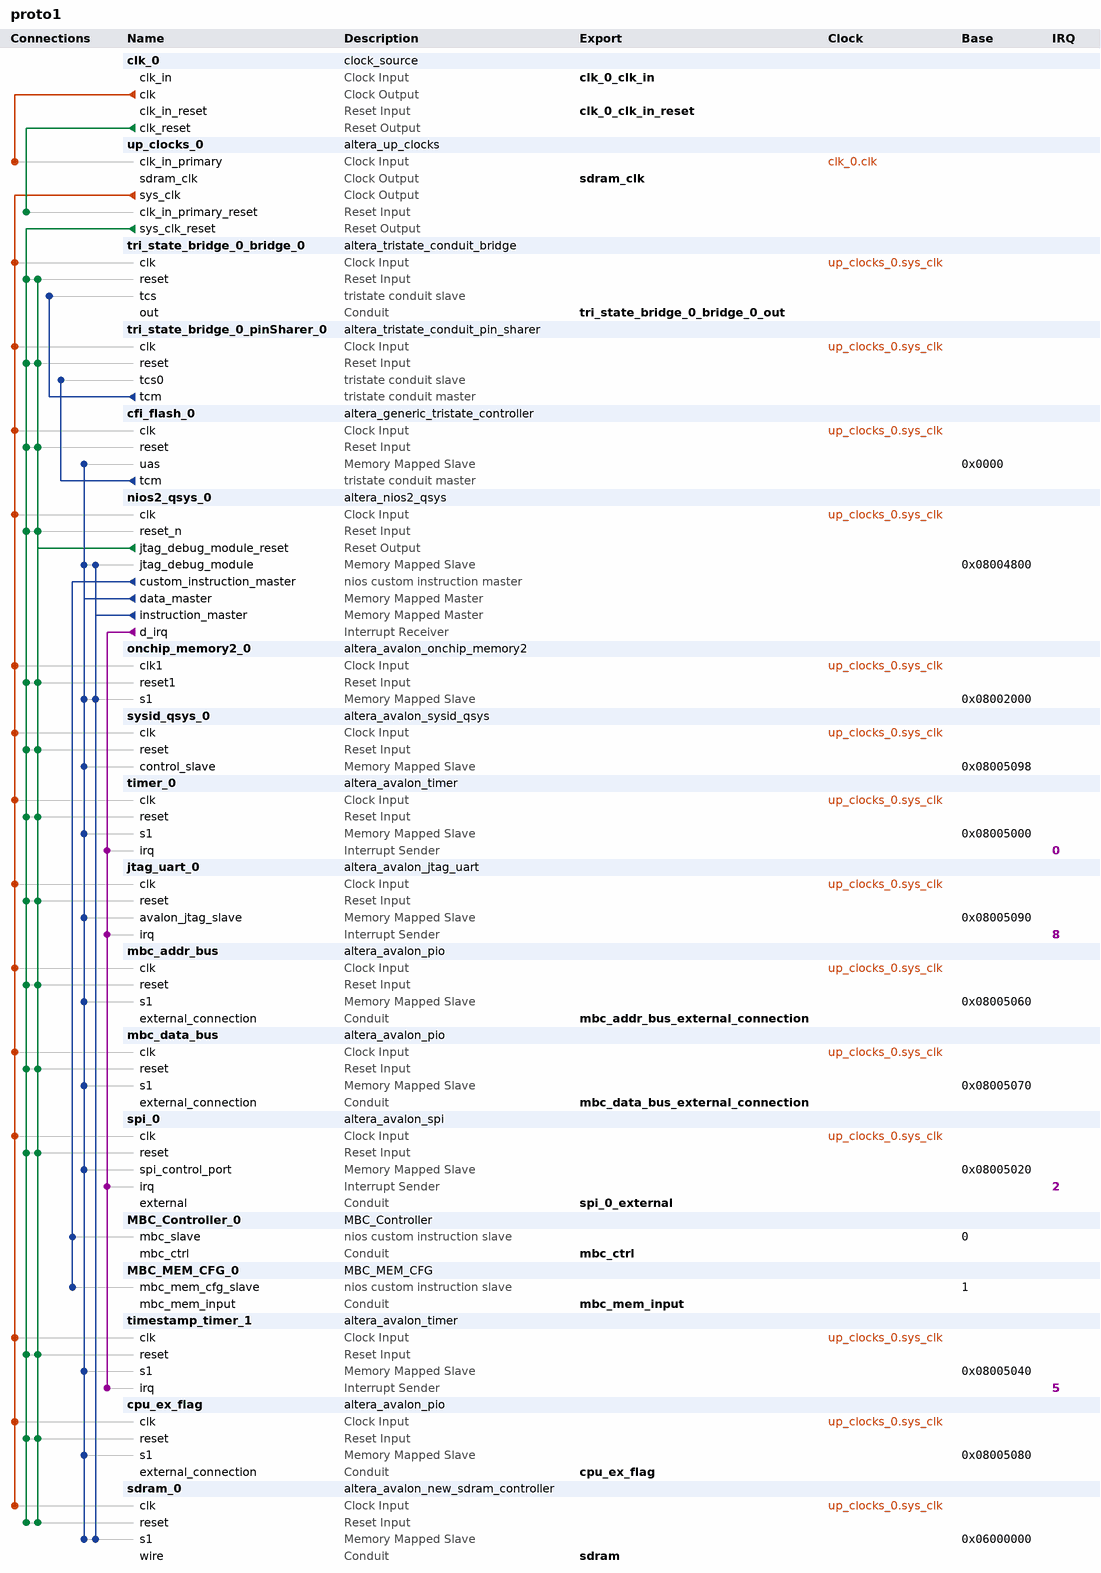
[diagram p0: system contents]
# Platform Designer (Qsys) system proto1, Cyclone IV E EP4CE22F17C6
# Parameters at their usual value, and those the tool derives, are not listed.
package require -exact qsys 12.0
create_system proto1
set_project_property DEVICE_FAMILY {Cyclone IV E}
set_project_property DEVICE EP4CE22F17C6

add_instance clk_0 clock_source 12.0
set_instance_parameter_value clk_0 clockFrequency 50000000

add_instance up_clocks_0 altera_up_clocks 12.0
set_instance_parameter_value up_clocks_0 board DE0-Nano
set_instance_parameter_value up_clocks_0 vga_clk false
set_instance_parameter_value up_clocks_0 audio_clk true
set_instance_parameter_value up_clocks_0 audio_clk_freq 12.288

add_instance tri_state_bridge_0_bridge_0 altera_tristate_conduit_bridge 12.0

add_instance tri_state_bridge_0_pinSharer_0 altera_tristate_conduit_pin_sharer 12.0
set_instance_parameter_value tri_state_bridge_0_pinSharer_0 NUM_INTERFACES 1
set_instance_parameter_value tri_state_bridge_0_pinSharer_0 MODULE_ORIGIN_LIST cfi_flash_0.tcm,cfi_flash_0.tcm,cfi_flash_0.tcm,cfi_flash_0.tcm,cfi_flash_0.tcm
set_instance_parameter_value tri_state_bridge_0_pinSharer_0 SHARED_SIGNAL_LIST address_to_the_cfi_flash_0,read_n_to_the_cfi_flash_0,write_n_to_the_cfi_flash_0,data_to_and_from_the_cfi_flash_0,select_n_to_the_cfi_flash_0

add_instance cfi_flash_0 altera_generic_tristate_controller 12.0
set_instance_parameter_value cfi_flash_0 TCM_ADDRESS_W 26
set_instance_parameter_value cfi_flash_0 TCM_DATA_W 16
set_instance_parameter_value cfi_flash_0 TCM_BYTEENABLE_W 2
set_instance_parameter_value cfi_flash_0 TCM_READ_WAIT 100
set_instance_parameter_value cfi_flash_0 TCM_WRITE_WAIT 100
set_instance_parameter_value cfi_flash_0 TCM_SETUP_WAIT 25
set_instance_parameter_value cfi_flash_0 TCM_DATA_HOLD 20
set_instance_parameter_value cfi_flash_0 TCM_MAX_PENDING_READ_TRANSACTIONS 3
set_instance_parameter_value cfi_flash_0 TCM_TURNAROUND_TIME 2
set_instance_parameter_value cfi_flash_0 TCM_TIMING_UNITS 0
set_instance_parameter_value cfi_flash_0 TCM_READLATENCY 2
set_instance_parameter_value cfi_flash_0 TCM_SYMBOLS_PER_WORD 2
set_instance_parameter_value cfi_flash_0 USE_READ 1
set_instance_parameter_value cfi_flash_0 USE_BEGINTRANSFER 0
set_instance_parameter_value cfi_flash_0 USE_BYTEENABLE 0
set_instance_parameter_value cfi_flash_0 USE_OUTPUTENABLE 0
set_instance_parameter_value cfi_flash_0 ACTIVE_LOW_READ 1
set_instance_parameter_value cfi_flash_0 ACTIVE_LOW_BYTEENABLE 0
set_instance_parameter_value cfi_flash_0 ACTIVE_LOW_OUTPUTENABLE 0
set_instance_parameter_value cfi_flash_0 ACTIVE_LOW_BEGINTRANSFER 0
set_instance_parameter_value cfi_flash_0 CHIPSELECT_THROUGH_READLATENCY 0
set_instance_parameter_value cfi_flash_0 MODULE_ASSIGNMENT_KEYS embeddedsw.configuration.hwClassnameDriverSupportList,embeddedsw.configuration.hwClassnameDriverSupportDefault,embeddedsw.CMacro.SETUP_VALUE,embeddedsw.CMacro.WAIT_VALUE,embeddedsw.CMacro.HOLD_VALUE,embeddedsw.CMacro.TIMING_UNITS,embeddedsw.CMacro.SIZE,embeddedsw.memoryInfo.MEM_INIT_DATA_WIDTH,embeddedsw.memoryInfo.HAS_BYTE_LANE,embeddedsw.memoryInfo.IS_FLASH,embeddedsw.memoryInfo.GENERATE_DAT_SYM,embeddedsw.memoryInfo.GENERATE_FLASH,embeddedsw.memoryInfo.DAT_SYM_INSTALL_DIR,embeddedsw.memoryInfo.FLASH_INSTALL_DIR
set_instance_parameter_value cfi_flash_0 MODULE_ASSIGNMENT_VALUES altera_avalon_lan91c111:altera_avalon_cfi_flash,altera_avalon_cfi_flash,25,100,20,ns,33554432u,16,1,1,1,1,SIM_DIR,APP_DIR
set_instance_parameter_value cfi_flash_0 INTERFACE_ASSIGNMENT_KEYS embeddedsw.configuration.isFlash,embeddedsw.configuration.isMemoryDevice,embeddedsw.configuration.isNonVolatileStorage
set_instance_parameter_value cfi_flash_0 INTERFACE_ASSIGNMENT_VALUES 1,1,1

add_instance nios2_qsys_0 altera_nios2_qsys 12.0
set_instance_parameter_value nios2_qsys_0 manuallyAssignCpuID false
set_instance_parameter_value nios2_qsys_0 resetSlave sdram_0.s1
set_instance_parameter_value nios2_qsys_0 exceptionSlave sdram_0.s1
set_instance_parameter_value nios2_qsys_0 breakSlave nios2_qsys_0.jtag_debug_module
set_instance_parameter_value nios2_qsys_0 impl Tiny
set_instance_parameter_value nios2_qsys_0 icache_size 4096

add_instance onchip_memory2_0 altera_avalon_onchip_memory2 12.0
set_instance_parameter_value onchip_memory2_0 allowInSystemMemoryContentEditor true
set_instance_parameter_value onchip_memory2_0 dataWidth 32
set_instance_parameter_value onchip_memory2_0 dualPort false
set_instance_parameter_value onchip_memory2_0 initMemContent true
set_instance_parameter_value onchip_memory2_0 initializationFileName onchip_memory2_0
set_instance_parameter_value onchip_memory2_0 instanceID MAIN
set_instance_parameter_value onchip_memory2_0 memorySize 8192
set_instance_parameter_value onchip_memory2_0 singleClockOperation true

add_instance sysid_qsys_0 altera_avalon_sysid_qsys 12.0
set_instance_parameter_value sysid_qsys_0 id 0

add_instance timer_0 altera_avalon_timer 12.0
set_instance_parameter_value timer_0 period 1
set_instance_parameter_value timer_0 periodUnits MSEC
set_instance_parameter_value timer_0 timerPreset FULL_FEATURED

add_instance jtag_uart_0 altera_avalon_jtag_uart 12.0
set_instance_parameter_value jtag_uart_0 simInteractiveOptions INTERACTIVE_ASCII_OUTPUT

add_instance mbc_addr_bus altera_avalon_pio 12.0
set_instance_parameter_value mbc_addr_bus direction Output
set_instance_parameter_value mbc_addr_bus width 5

add_instance mbc_data_bus altera_avalon_pio 12.0
set_instance_parameter_value mbc_data_bus direction Input
set_instance_parameter_value mbc_data_bus width 8

add_instance spi_0 altera_avalon_spi 12.0
set_instance_parameter_value spi_0 clockPolarity 0
set_instance_parameter_value spi_0 dataWidth 32
set_instance_parameter_value spi_0 masterSPI true
set_instance_parameter_value spi_0 numberOfSlaves 1
set_instance_parameter_value spi_0 targetClockRate 128000

add_instance MBC_Controller_0 MBC_Controller 1.8
set_instance_parameter_value MBC_Controller_0 DEFAULT_LUT_SIZE 256
set_instance_parameter_value MBC_Controller_0 DEFAULT_SCHED_TBL_SIZE 16

add_instance MBC_MEM_CFG_0 MBC_MEM_CFG 1.2

add_instance timestamp_timer_1 altera_avalon_timer 12.0
set_instance_parameter_value timestamp_timer_1 period 1
set_instance_parameter_value timestamp_timer_1 periodUnits MSEC
set_instance_parameter_value timestamp_timer_1 timerPreset FULL_FEATURED

add_instance cpu_ex_flag altera_avalon_pio 12.0
set_instance_parameter_value cpu_ex_flag direction Output
set_instance_parameter_value cpu_ex_flag width 1

add_instance sdram_0 altera_avalon_new_sdram_controller 12.0
set_instance_parameter_value sdram_0 TAC 5.5
set_instance_parameter_value sdram_0 TRCD 20.0
set_instance_parameter_value sdram_0 TRP 20.0
set_instance_parameter_value sdram_0 casLatency 3
set_instance_parameter_value sdram_0 columnWidth 9
set_instance_parameter_value sdram_0 dataWidth 16
set_instance_parameter_value sdram_0 generateSimulationModel false
set_instance_parameter_value sdram_0 model custom
set_instance_parameter_value sdram_0 numberOfBanks 4
set_instance_parameter_value sdram_0 numberOfChipSelects 1
set_instance_parameter_value sdram_0 powerUpDelay 100.0
set_instance_parameter_value sdram_0 refreshPeriod 15.625
set_instance_parameter_value sdram_0 rowWidth 13

# connections
add_connection clk_0.clk up_clocks_0.clk_in_primary clock
add_connection up_clocks_0.sys_clk cfi_flash_0.clk clock
add_connection up_clocks_0.sys_clk cpu_ex_flag.clk clock
add_connection up_clocks_0.sys_clk jtag_uart_0.clk clock
add_connection up_clocks_0.sys_clk mbc_addr_bus.clk clock
add_connection up_clocks_0.sys_clk mbc_data_bus.clk clock
add_connection up_clocks_0.sys_clk nios2_qsys_0.clk clock
add_connection up_clocks_0.sys_clk onchip_memory2_0.clk1 clock
add_connection up_clocks_0.sys_clk sdram_0.clk clock
add_connection up_clocks_0.sys_clk spi_0.clk clock
add_connection up_clocks_0.sys_clk sysid_qsys_0.clk clock
add_connection up_clocks_0.sys_clk timer_0.clk clock
add_connection up_clocks_0.sys_clk timestamp_timer_1.clk clock
add_connection up_clocks_0.sys_clk tri_state_bridge_0_bridge_0.clk clock
add_connection up_clocks_0.sys_clk tri_state_bridge_0_pinSharer_0.clk clock
add_connection clk_0.clk_reset up_clocks_0.clk_in_primary_reset reset
add_connection nios2_qsys_0.jtag_debug_module_reset cfi_flash_0.reset reset
add_connection nios2_qsys_0.jtag_debug_module_reset cpu_ex_flag.reset reset
add_connection nios2_qsys_0.jtag_debug_module_reset jtag_uart_0.reset reset
add_connection nios2_qsys_0.jtag_debug_module_reset mbc_addr_bus.reset reset
add_connection nios2_qsys_0.jtag_debug_module_reset mbc_data_bus.reset reset
add_connection nios2_qsys_0.jtag_debug_module_reset nios2_qsys_0.reset_n reset
add_connection nios2_qsys_0.jtag_debug_module_reset onchip_memory2_0.reset1 reset
add_connection nios2_qsys_0.jtag_debug_module_reset sdram_0.reset reset
add_connection nios2_qsys_0.jtag_debug_module_reset spi_0.reset reset
add_connection nios2_qsys_0.jtag_debug_module_reset sysid_qsys_0.reset reset
add_connection nios2_qsys_0.jtag_debug_module_reset timer_0.reset reset
add_connection nios2_qsys_0.jtag_debug_module_reset timestamp_timer_1.reset reset
add_connection nios2_qsys_0.jtag_debug_module_reset tri_state_bridge_0_bridge_0.reset reset
add_connection nios2_qsys_0.jtag_debug_module_reset tri_state_bridge_0_pinSharer_0.reset reset
add_connection up_clocks_0.sys_clk_reset cfi_flash_0.reset reset
add_connection up_clocks_0.sys_clk_reset cpu_ex_flag.reset reset
add_connection up_clocks_0.sys_clk_reset jtag_uart_0.reset reset
add_connection up_clocks_0.sys_clk_reset mbc_addr_bus.reset reset
add_connection up_clocks_0.sys_clk_reset mbc_data_bus.reset reset
add_connection up_clocks_0.sys_clk_reset nios2_qsys_0.reset_n reset
add_connection up_clocks_0.sys_clk_reset onchip_memory2_0.reset1 reset
add_connection up_clocks_0.sys_clk_reset sdram_0.reset reset
add_connection up_clocks_0.sys_clk_reset spi_0.reset reset
add_connection up_clocks_0.sys_clk_reset sysid_qsys_0.reset reset
add_connection up_clocks_0.sys_clk_reset timer_0.reset reset
add_connection up_clocks_0.sys_clk_reset timestamp_timer_1.reset reset
add_connection up_clocks_0.sys_clk_reset tri_state_bridge_0_bridge_0.reset reset
add_connection up_clocks_0.sys_clk_reset tri_state_bridge_0_pinSharer_0.reset reset
add_connection nios2_qsys_0.data_master cfi_flash_0.uas avalon
set_connection_parameter_value nios2_qsys_0.data_master/cfi_flash_0.uas baseAddress 0x0000
add_connection nios2_qsys_0.data_master cpu_ex_flag.s1 avalon
set_connection_parameter_value nios2_qsys_0.data_master/cpu_ex_flag.s1 baseAddress 0x08005080
add_connection nios2_qsys_0.data_master jtag_uart_0.avalon_jtag_slave avalon
set_connection_parameter_value nios2_qsys_0.data_master/jtag_uart_0.avalon_jtag_slave baseAddress 0x08005090
add_connection nios2_qsys_0.data_master mbc_addr_bus.s1 avalon
set_connection_parameter_value nios2_qsys_0.data_master/mbc_addr_bus.s1 baseAddress 0x08005060
add_connection nios2_qsys_0.data_master mbc_data_bus.s1 avalon
set_connection_parameter_value nios2_qsys_0.data_master/mbc_data_bus.s1 baseAddress 0x08005070
add_connection nios2_qsys_0.data_master nios2_qsys_0.jtag_debug_module avalon
set_connection_parameter_value nios2_qsys_0.data_master/nios2_qsys_0.jtag_debug_module baseAddress 0x08004800
add_connection nios2_qsys_0.data_master onchip_memory2_0.s1 avalon
set_connection_parameter_value nios2_qsys_0.data_master/onchip_memory2_0.s1 baseAddress 0x08002000
add_connection nios2_qsys_0.data_master sdram_0.s1 avalon
set_connection_parameter_value nios2_qsys_0.data_master/sdram_0.s1 baseAddress 0x06000000
add_connection nios2_qsys_0.data_master spi_0.spi_control_port avalon
set_connection_parameter_value nios2_qsys_0.data_master/spi_0.spi_control_port baseAddress 0x08005020
add_connection nios2_qsys_0.data_master sysid_qsys_0.control_slave avalon
set_connection_parameter_value nios2_qsys_0.data_master/sysid_qsys_0.control_slave baseAddress 0x08005098
add_connection nios2_qsys_0.data_master timer_0.s1 avalon
set_connection_parameter_value nios2_qsys_0.data_master/timer_0.s1 baseAddress 0x08005000
add_connection nios2_qsys_0.data_master timestamp_timer_1.s1 avalon
set_connection_parameter_value nios2_qsys_0.data_master/timestamp_timer_1.s1 baseAddress 0x08005040
add_connection nios2_qsys_0.instruction_master nios2_qsys_0.jtag_debug_module avalon
set_connection_parameter_value nios2_qsys_0.instruction_master/nios2_qsys_0.jtag_debug_module baseAddress 0x08004800
add_connection nios2_qsys_0.instruction_master onchip_memory2_0.s1 avalon
set_connection_parameter_value nios2_qsys_0.instruction_master/onchip_memory2_0.s1 baseAddress 0x08002000
add_connection nios2_qsys_0.instruction_master sdram_0.s1 avalon
set_connection_parameter_value nios2_qsys_0.instruction_master/sdram_0.s1 baseAddress 0x06000000
add_connection nios2_qsys_0.d_irq jtag_uart_0.irq interrupt
set_connection_parameter_value nios2_qsys_0.d_irq/jtag_uart_0.irq irqNumber 8
add_connection nios2_qsys_0.d_irq spi_0.irq interrupt
set_connection_parameter_value nios2_qsys_0.d_irq/spi_0.irq irqNumber 2
add_connection nios2_qsys_0.d_irq timer_0.irq interrupt
set_connection_parameter_value nios2_qsys_0.d_irq/timer_0.irq irqNumber 0
add_connection nios2_qsys_0.d_irq timestamp_timer_1.irq interrupt
set_connection_parameter_value nios2_qsys_0.d_irq/timestamp_timer_1.irq irqNumber 5
add_connection nios2_qsys_0.custom_instruction_master MBC_Controller_0.mbc_slave nios_custom_instruction
set_connection_parameter_value nios2_qsys_0.custom_instruction_master/MBC_Controller_0.mbc_slave CIName mbc_controller_0
set_connection_parameter_value nios2_qsys_0.custom_instruction_master/MBC_Controller_0.mbc_slave baseAddress 0
add_connection nios2_qsys_0.custom_instruction_master MBC_MEM_CFG_0.mbc_mem_cfg_slave nios_custom_instruction
set_connection_parameter_value nios2_qsys_0.custom_instruction_master/MBC_MEM_CFG_0.mbc_mem_cfg_slave CIName mbc_mem_cfg_0
set_connection_parameter_value nios2_qsys_0.custom_instruction_master/MBC_MEM_CFG_0.mbc_mem_cfg_slave baseAddress 1
add_connection cfi_flash_0.tcm tri_state_bridge_0_pinSharer_0.tcs0 tristate_conduit
add_connection tri_state_bridge_0_pinSharer_0.tcm tri_state_bridge_0_bridge_0.tcs tristate_conduit

# exported interfaces
add_interface clk_0_clk_in clock sink
set_interface_property clk_0_clk_in EXPORT_OF clk_0.clk_in
add_interface clk_0_clk_in_reset reset sink
set_interface_property clk_0_clk_in_reset EXPORT_OF clk_0.clk_in_reset
add_interface tri_state_bridge_0_bridge_0_out conduit end
set_interface_property tri_state_bridge_0_bridge_0_out EXPORT_OF tri_state_bridge_0_bridge_0.out
add_interface mbc_addr_bus_external_connection conduit end
set_interface_property mbc_addr_bus_external_connection EXPORT_OF mbc_addr_bus.external_connection
add_interface mbc_data_bus_external_connection conduit end
set_interface_property mbc_data_bus_external_connection EXPORT_OF mbc_data_bus.external_connection
add_interface spi_0_external conduit end
set_interface_property spi_0_external EXPORT_OF spi_0.external
add_interface mbc_ctrl conduit end
set_interface_property mbc_ctrl EXPORT_OF MBC_Controller_0.mbc_ctrl
add_interface mbc_mem_input conduit end
set_interface_property mbc_mem_input EXPORT_OF MBC_MEM_CFG_0.mbc_mem_input
add_interface cpu_ex_flag conduit end
set_interface_property cpu_ex_flag EXPORT_OF cpu_ex_flag.external_connection
add_interface sdram conduit end
set_interface_property sdram EXPORT_OF sdram_0.wire
add_interface sdram_clk clock source
set_interface_property sdram_clk EXPORT_OF up_clocks_0.sdram_clk

save_system proto1.qsys
